# Altium schematic sheet BV100011_EERAM.SchDoc
size A
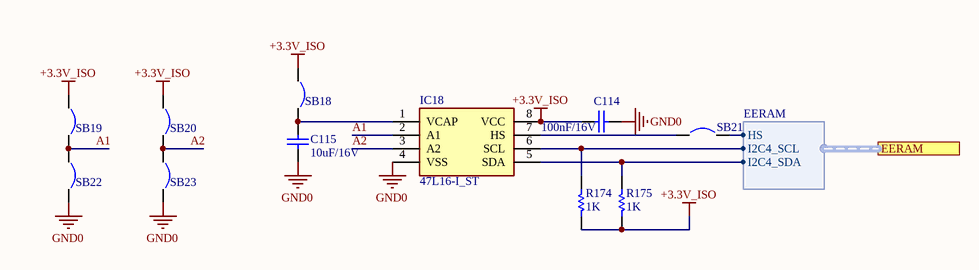
[diagram p0: BV100011_EERAM.SchDoc]

## Parts
C114  100nF/16V  [C1210]
C115  10uF/16V  [C1210]
IC18  47L16-I_ST  [SOP65P640X120-8N]
R174  1K  [0402R]
R175  1K  [0402R]
SB18  Circuit Breaker  [SB_0603]  (value not drawn)
SB19  Circuit Breaker  [SB_0603]  (value not drawn)
SB20  Circuit Breaker  [SB_0603]  (value not drawn)
SB21  Circuit Breaker  [SB_0603]  (value not drawn)
SB22  Circuit Breaker  [SB_0603]  (value not drawn)
SB23  Circuit Breaker  [SB_0603]  (value not drawn)

## Ports
EERAM (harness EERAM)

## Harnesses
EERAM: HS, I2C4_SCL, I2C4_SDA

## Nets
+3.3V_ISO: C114.2 IC18.8(VCC) R174.1 R175.1 SB18.1 SB19.1 SB20.1
GND0: C114.1 C115.1 IC18.4(VSS) SB22.2 SB23.2
A1: IC18.2(A1) SB19.2 SB22.1
A2: IC18.3(A2) SB20.2 SB23.1
NetC115_2: C115.2 IC18.1(VCAP) SB18.2
NetIC18_5: IC18.5(SDA) R175.2 ; port EERAM.I2C4_SDA
NetIC18_6: IC18.6(SCL) R174.2 ; port EERAM.I2C4_SCL
NetIC18_7: IC18.7(HS) SB21.1
NetSB21_2: SB21.2 ; port EERAM.HS

## Library data of the parts
C114 C115 = Cap Semi: Capacitor (Semiconductor SIM Model); Value: 2.2nF/50V; Published: 8-Jun-2000; LatestRevisionDate: 29-May-2009; LatestRevisionNote: IPC-7351 Footprint Added.; PackageReference: C1206; Publisher: Altium Limited; PackageDescription: Chip Capacitor
IC18 = 47L16-I_ST: Integrated Circuit; Manufacturer_Name: Microchip; Manufacturer_Part_Number: 47L16-I/ST; Datasheet Link: http://ww1.microchip.com/downloads/en/DeviceDoc/20005371C.pdf; Height: 1.2mm; Arrow Part Number: 47L16-I/ST; Arrow Price/Stock: https://www.arrow.com/en/products/47l16-ist/microchip-technology; Mouser Part Number: 579-47L16-I/ST; Mouser Price/Stock: https://www.mouser.co.uk/ProductDetail/Microchip-Technology/47L16-I-ST?qs=vH2uEH3KBjXyAWKjlRLYHg%3D%3D
R174 R175 = Res1: Resistor; Published: 8-Jun-2000; Revision: July-2002: Re-released for DXP Platform.; Publisher: Altium Limited; Value: 1K
SB18-SB23 = Circuit Breaker: Solder: NO; Published: 24-Mar-1999; Revision: July-2002: Re-released for DXP Platform.; Publisher: Altium Limited